# EAGLE design TorquePotSch (EAGLE 9.5.1)
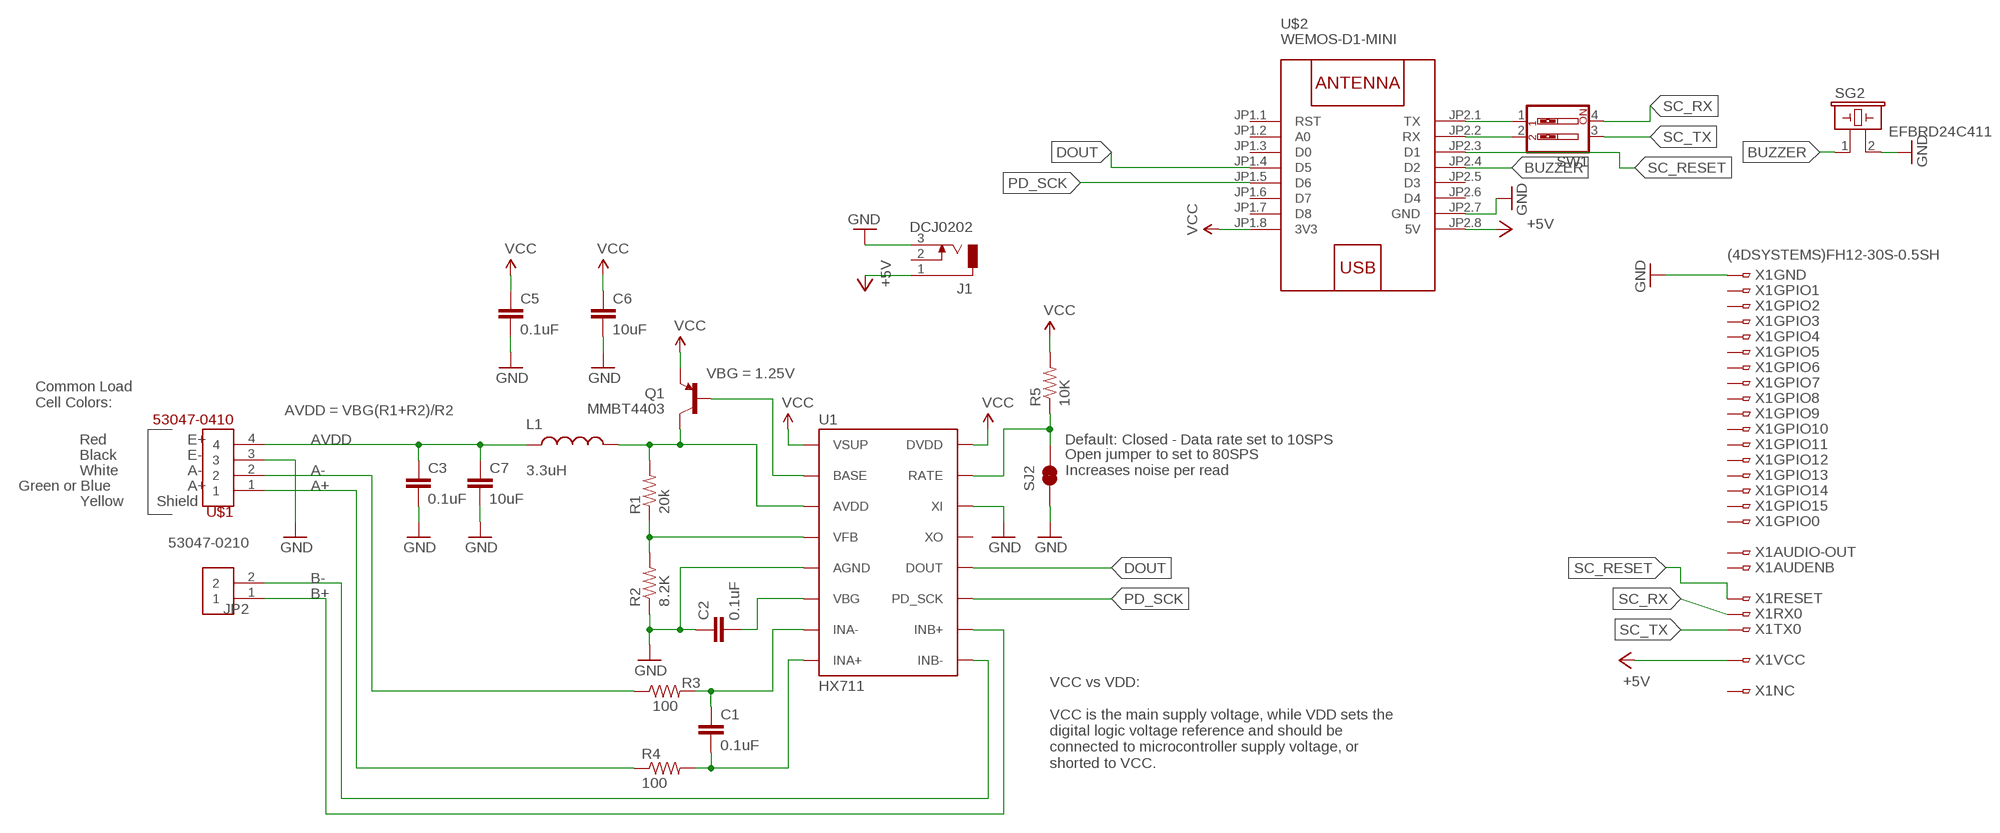
[diagram p0: schematic, sheet 1]

## Parts
C1  0.1uF  0.1UF-25V-5%(0603)  [0603-CAP]
C2  0.1uF  0.1UF-25V-5%(0603)  [0603-CAP]
C3  0.1uF  0.1UF-25V-5%(0603)  [0603-CAP]
C5  0.1uF  0.1UF-25V-5%(0603)  [0603-CAP]
C6  10uF  10UF50V20%(1210)  [1210]
C7  10uF  10UF50V20%(1210)  [1210]
J1  DCJ0202  [DCJ0202]
JP2  53047-0210  [53047-0210]
L1  3.3uH  INDUCTOR0805-IND  [0805]
Q1  MMBT4403  TRANSISTOR_PNPMMBT4403  [SOT23-3]
R1  20k  20KOHM1/10W1%(0603)  [0603-RES]
R2  8.2K  8.2KOHM-1/10W-5%(0603)  [0603-RES]
R3  100  100OHM-1/10W-1%(0603)  [0603-RES]
R4  100  100OHM-1/10W-1%(0603)  [0603-RES]
R5  10K  10KOHM-1/10W-1%(0603)0603  [0603-RES]
SG2  EFBRD24C411  [RS511-7620]
SJ2  JUMPER-PAD-2-NC_BY_TRACE  [PAD-JUMPER-2-NC_BY_TRACE_YES_SILK]
SW1  SW_DIP-2  [EDG-02]
U1  HX711  HX711HX711  [SO16]
U$1  53047-0410  [53047-0410]
U$2  WEMOS-D1-MINI  [WEMOS-D1-MINI]
X1  (4DSYSTEMS)FH12-30S-0.5SH  [FH12-30S-0.5SH]

## Nets
+5V: J1.1 U$2.JP2.8(5V) X1.26 X1.27
A+: R4.1 U$1.1
A-: R3.1 U$1.2
AVDD: C3.1 C7.1 L1.1 U$1.4
B+: JP2.1 U1.10(INB+)
B-: JP2.2 U1.9(INB-)
BUZZER: SG2.1 U$2.JP2.4(D2)
DOUT: U1.12(DOUT) U$2.JP1.4(D5)
GND: C2.1 C3.2 C5.2 C6.2 C7.2 J1.3 R2.1 SG2.2 SJ2.1 U1.5(AGND) U1.14(XI) U$1.3 U$2.JP2.7(GND) X1.1 X1.21 X1.25 X1.30
N$1: R5.1 SJ2.2 U1.15(RATE)
N$2: C1.1 R3.2 U1.7(INA-)
N$3: C1.2 R4.2 U1.8(INA+)
N$4: Q1.1(B) U1.2(BASE)
N$5: L1.2 Q1.3(C) R1.2 U1.3(AVDD)
N$6: R1.1 R2.2 U1.4(VFB)
N$7: C2.2 U1.6(VBG)
N$8: SW1.1 U$2.JP2.1(TX)
N$9: SW1.2 U$2.JP2.2(RX)
PD_SCK: U1.11(PD_SCK) U$2.JP1.5(D6)
SC_RESET: U$2.JP2.3(D1) X1.22
SC_RX: SW1.4 X1.23
SC_TX: SW1.3 X1.24
VCC: C5.1 C6.1 Q1.2(E) R5.2 U1.1(VSUP) U1.16(DVDD) U$2.JP1.8(3V3)
Unconnected: J1.2 U1.13(XO) U$2.JP1.1(RST) U$2.JP1.2(A0) U$2.JP1.3(D0) U$2.JP1.6(D7) U$2.JP1.7(D8) U$2.JP2.5(D3) U$2.JP2.6(D4) X1.2 X1.3 X1.4 X1.5 X1.6 X1.7 X1.8 X1.9 X1.10 X1.11 X1.12 X1.13 X1.14 X1.15 X1.16 X1.17 X1.18 X1.19 X1.20 X1.28 X1.29

## Notes on the sheet
- VBG = 1.25V
- Common Load
  Cell Colors:
- AVDD = VBG(R1+R2)/R2
- Red | E+ | Default: Closed - Data rate set to 10SPS
- Black | E-
- White | A-
- Open jumper to set to 80SPS
  Increases noise per read
- Green or Blue | A+
- Yellow | Shield
- VCC vs VDD:
  
  VCC is the main supply voltage, while VDD sets the
  digital logic voltage reference and should be
  connected to microcontroller supply voltage, or
  shorted to VCC.

## Library data of the parts
C1-C3 C5 = SparkFun-Capacitors:0.1UF-25V-5%(0603): CAP-08604; PROD_ID: CAP-08604
C6 C7 = SparkFun-Capacitors:10UF50V20%(1210): CAP-09824; PROD_ID: CAP-09824
J1 = personal:DCJ0202: DC POWER JACK Source: DCJ0202.pdf; OC_FARNELL: unknown; OC_NEWARK: unknown
JP2 = personal:53047-0210: Molex Picoblade 3 way PCB Header; SPICEPREFIX: B
L1 = SparkFun-Passives:INDUCTOR: Inductors Basic Inductor/Choke - 0603 and 1206. Footprints are not proven and vary greatly between part numbers. INDUCTOR POWER 3.3UH 4.0A SMD 0.197" L x 0.197" W x 0.177" H (5.00mm x 5.00mm x 4.50mm); PROD_ID: NDUC-13076
Q1 = SparkFun-DiscreteSemi:TRANSISTOR_PNP: Generic PNP BJT Double check pinouts against datasheets- not all devices are the same! MMBT3906 - 40V 200mA SOT-23 (TRANS-08052) MMBT4403 - 40V 600mA SOT-23 (TRANS-09245); PROD_ID: TRANS-09245
R1 = SparkFun-Resistors:20KOHM1/10W1%(0603): RES-09383; PROD_ID: RES-09383
R2 = SparkFun-Resistors:8.2KOHM-1/10W-5%(0603): RES-10646; PROD_ID: RES-10646
R3 R4 = SparkFun-Resistors:100OHM-1/10W-1%(0603): RES-07863; PROD_ID: RES-07863
R5 = SparkFun-Resistors:10KOHM-1/10W-1%(0603): RES-00824; PROD_ID: RES-00824
SG2 = personal:EFB?: Piezoelectric Acoustic Transducer Source: Panbasonic .. 2SC1685.pdf; OC_FARNELL: unknown; OC_NEWARK: unknown
SJ2 = SparkFun-Passives:JUMPER-PAD-2-NC_BY_TRACE
SW1 = personal:SW_DIP-2: DIP SWITCH
U1 = Testing:HX711; PROD_ID: IC-12445
U$1 = personal:53047-0410: Molex Picoblade 4 way PCB Header
U$2 = diy-modules:WEMOS-D1-MINI: WEMOS D1 mini: Mini Wi-Fi Board based on ESP-8266 device More details can be found here: https://www.wemos.cc/product/d1-mini.html Click here to find device on ebay.com <http://www.ebay.com/sch/wemos+d1+mini+nodemcu>
X1 = personal:(4DSYSTEMS)FH12-30S-0.5S: 0.5mm Pitch Connectors For FPC/FFC Source: Data sheet <http://www.hirose.co.jp/cataloge_hp/e58605370.pdf> 4d systems data sheet: Data sheet <https://4dsystems.com.au/mwdownloads/download/link/id/70/>; MPN: FH12-30S-0.5SH(55); OC_FARNELL: 1324555; OC_NEWARK: 34M6176

## Board
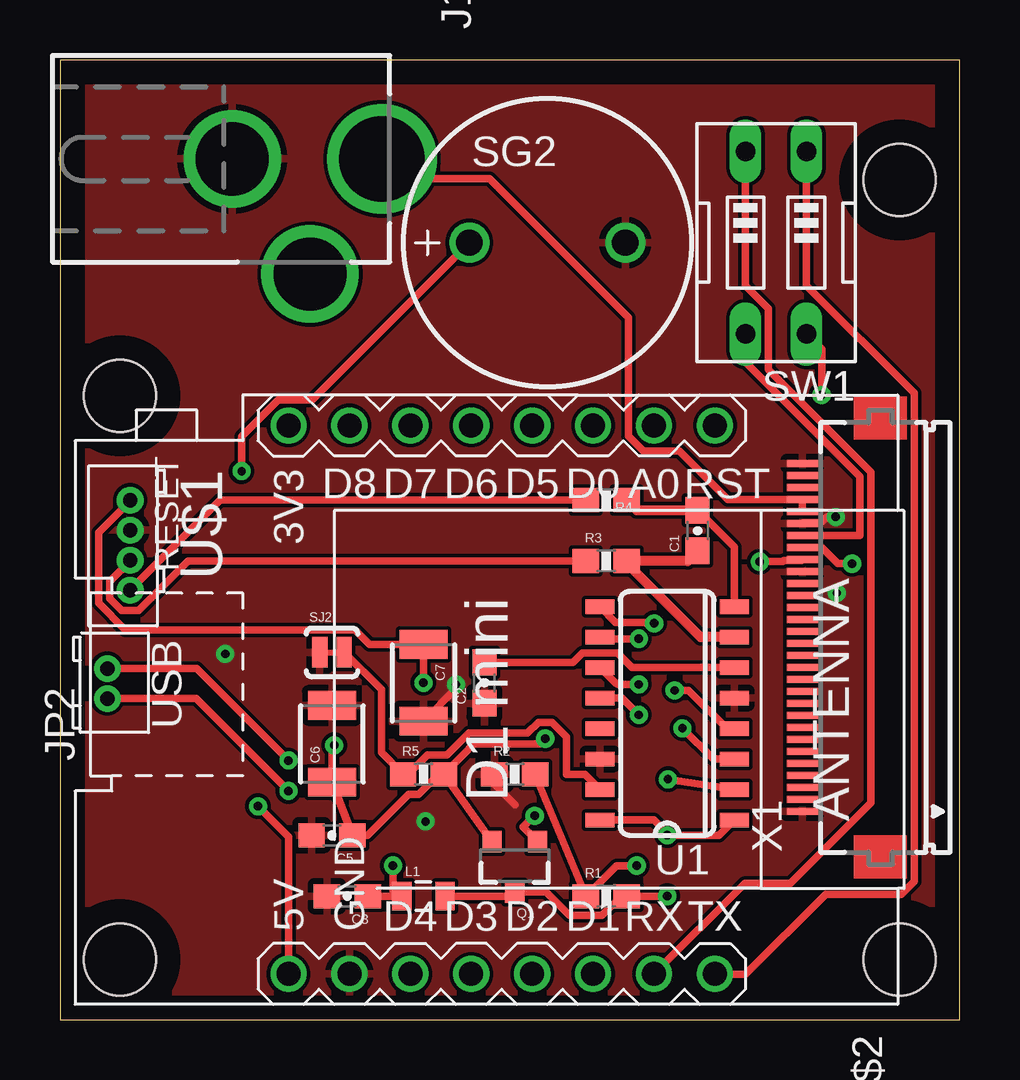
[diagram p1: board, top side]
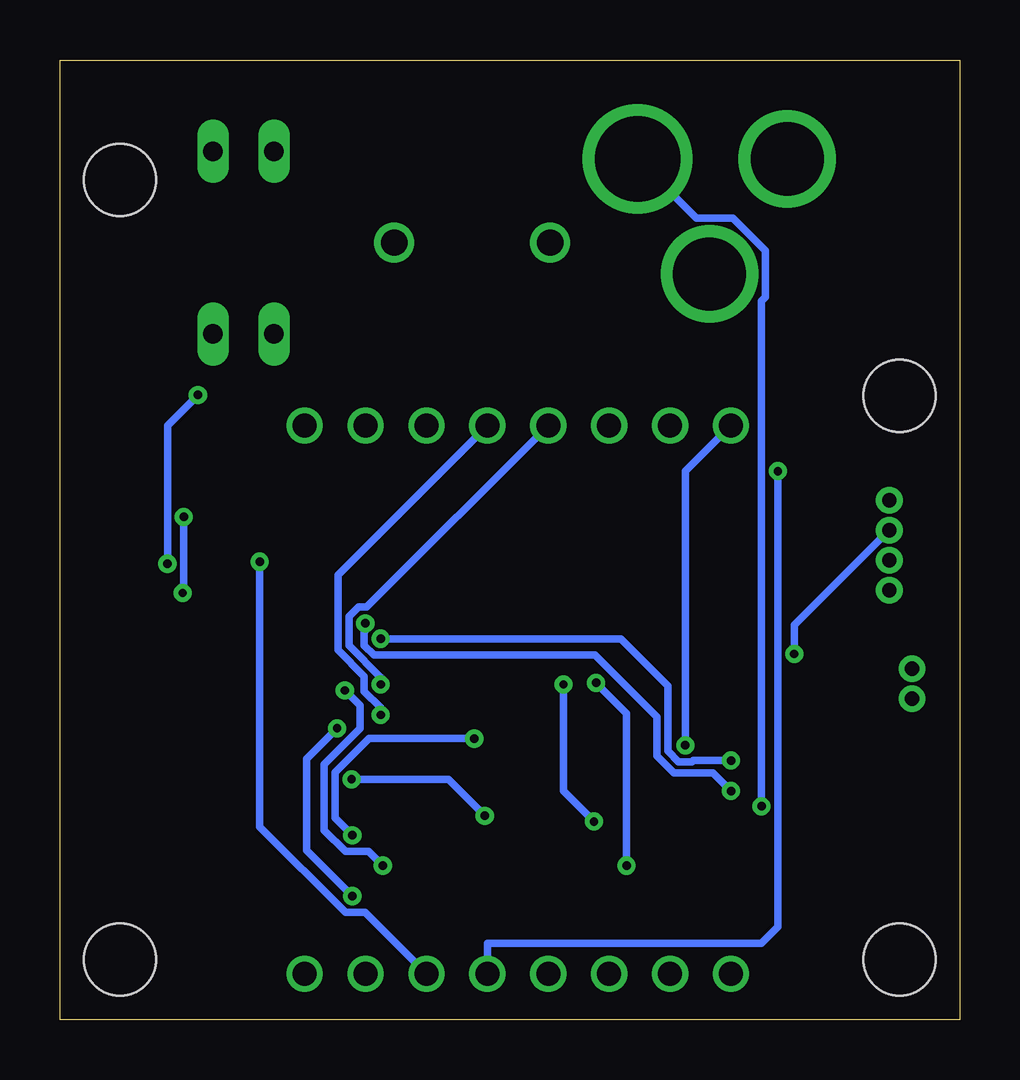
[diagram p2: board, bottom side, seen from below]

Size 37.5 x 40 mm. Coordinates in mm from the lower left corner, seen from the top.
Outline: 0,0 37.5,0 37.5,40 0,40 0,0
Copper layers (1*16): Top 0.035mm / dielectric 1.5mm / Bottom 0.035mm
Design rules "default": minimum track width 6mil, minimum drill 0.35mm, track to track 6mil, track to pad 6mil, pad to pad 6mil, via to via 6mil, smd to smd 6mil, copper to edge 40mil, drill to drill 6mil, minimum pad ring 10mil, minimum via ring 8mil, stop-mask expansion 4mil, vias tented up to drill 0mil, thermal gap 10mil
Holes 3 mm at 2.5,26 35,35 2.5,2.5 35,2.5

### Footprints (pad centres in the part's own frame; a part is rotated, then mirrored left to right if it is on the bottom)
0603-CAP = smd 1.1 x 1: 1 -0.85,0; 2 0.85,0
1210 = smd 1.2 x 2: 1 -1.6,0; 2 1.6,0
DCJ0202 = drill 3.56: 1 0,13.74 | drill 3.05: 2 4.8,10.74; 3 0,7.498
53047-0210 = drill 0.6 pad 1.016: 1 2.5,0.475; 2 1.25,0.475
0805 = smd 0.8 x 1.2: 1 -0.9,0; 2 0.9,0
SOT23-3 = smd 0.8 x 0.9: 1 -0.95,-1; 2 0.95,-1; 3 0,1.1
0603-RES = smd 1.1 x 1: 1 -0.85,0; 2 0.85,0
RS511-7620 = drill 1.1 pad 1.676: 1 -3.25,0; 2 3.25,0
PAD-JUMPER-2-NC_BY_TRACE_YES_SILK = smd 0.635 x 1.27: 1 -0.508,0; 2 0.508,0
EDG-02 = drill 0.813 long: 1 -1.27,-3.81; 2 1.27,-3.81; 3 1.27,3.81; 4 -1.27,3.81
SO16 = smd 0.6 x 1.2: 1 -4.445,-2.8; 2 -3.175,-2.8; 3 -1.905,-2.8; 4 -0.635,-2.8; 5 0.635,-2.8; 6 1.905,-2.8; 7 3.175,-2.8; 8 4.445,-2.8; 9 4.445,2.8; 10 3.175,2.8; 11 1.905,2.8; 12 0.635,2.8; 13 -0.635,2.8; 14 -1.905,2.8; 15 -3.175,2.8; 16 -4.445,2.8
53047-0410 = drill 0.6 pad 1.016: 1 3.75,0.475; 2 2.5,0.475; 3 1.25,0.475; 4 0,0.475
WEMOS-D1-MINI = drill 1: JP1.1 -11.43,9.525; JP1.2 -11.43,6.985; JP1.3 -11.43,4.445; JP1.4 -11.43,1.905; JP1.5 -11.43,-0.635; JP1.6 -11.43,-3.175; JP1.7 -11.43,-5.715; JP1.8 -11.43,-8.255; JP2.1 11.43,9.525; JP2.2 11.43,6.985; JP2.3 11.43,4.445; JP2.4 11.43,1.905; JP2.5 11.43,-0.635; JP2.6 11.43,-3.175; JP2.7 11.43,-5.715; JP2.8 11.43,-8.255
FH12-30S-0.5SH = smd 0.3 x 1.3: 1 -7.25,3.25; 2 -6.75,3.25; 3 -6.25,3.25; 4 -5.75,3.25; 5 -5.25,3.25; 6 -4.75,3.25; 7 -4.25,3.25; 8 -3.75,3.25; 9 -3.25,3.25; 10 -2.75,3.25; 11 -2.25,3.25; 12 -1.75,3.25; 13 -1.25,3.25; 14 -0.75,3.25; 15 -0.25,3.25; 16 0.25,3.25; 17 0.75,3.25; 18 1.25,3.25; 19 1.75,3.25; 20 2.25,3.25; 21 2.75,3.25; 22 3.25,3.25; 23 3.75,3.25; 24 4.25,3.25; 25 4.75,3.25; 26 5.25,3.25; 27 5.75,3.25; 28 6.25,3.25; 29 6.75,3.25; 30 7.25,3.25

### Placement (x,y rotation side)
C1  26.58,20.38 90 top
C2  17.69,14.03 90 top
C3  11.98,5.14 180 top
C5  11.34,7.68 180 top
C6  11.34,11.49 90 top
C7  15.15,14.03 270 top
J1  -0.32,35.88 270 top
JP2  2.45,12.13 90 top
L1  15.15,5.14 0 top
Q1  18.96,6.41 180 top
R1  22.77,5.14 0 top
R2  18.96,10.22 0 top
R3  22.77,19.11 0 top
R4  22.77,21.65 0 top
R5  15.15,10.22 0 top
SG2  20.32,32.38 0 top
SJ2  11.34,15.3 0 top
SW1  29.84,32.38 180 top
U1  25.31,12.76 90 top
U$1  2.45,21.65 270 top
U$2  17.78,13.34 270 top
X1  34.2,15.93 90 top

### Tracks (layer width: path | path; a pad name or v marks a point on that pad's centre or on a via)
+5V  (via drill 0.35)
  Top 0.305: U$2.JP2.8 9.53,7.62 v8.26,8.89 | X1.26 X1.27 27.85,21.68 25.82,23.71 24.33,23.71 23.71,24.33 23.71,29.27 17.92,35.06 14.24,35.06 J1.1
  Bottom 0.305: v8.26,8.89 8.26,29.94 8.09,30.11 8.09,32.05 9.45,33.41 10.96,33.41 J1.1
A+
  Top 0.305: R4.1 6.68,21.65 U$1.1
A-
  Top 0.305: U$1.2 2.97,19.11 2.62,18.76 2.57,18.76 2.07,18.26 2.07,17.55 2.57,17.05 3.28,17.05 5.35,19.11 R3.1
AVDD  (via drill 0.35)
  Top 0.305: L1.1 13.88,5.14 | 13.88,5.14 C3.1 | v13.88,6.41 13.88,5.14 | U$1.4 2.93,21.62 1.61,20.3 1.61,17.36 2.73,16.24 12.29,16.24 12.9,15.63 C7.1 v15.15,14.03
  Bottom 0.305: v15.15,14.03 13.88,12.76 v13.88,6.41
B+  (via drill 0.35)
  Top 0.305: v9.53,10.79 5.69,14.63 JP2.1 | v24.13,15.88 22.57,15.88 U1.10
  Bottom 0.305: v9.53,10.79 11.1,10.79 11.15,10.75 11.71,10.75 12.15,11.19 12.15,13.91 14.12,15.88 v24.13,15.88
B-  (via drill 0.35)
  Top 0.305: v9.53,9.53 5.67,13.38 JP2.2 | v24.77,16.52 24.45,16.52 24.41,16.56 23.16,16.56 U1.9
  Bottom 0.305: v24.77,16.52 24.77,16.2 24.81,16.16 24.81,15.59 24.41,15.19 15.19,15.19 12.61,12.61 12.61,11 11.9,10.29 10.29,10.29 v9.53,9.53
BUZZER  (via drill 0.35)
  Top 0.305: SG2.1 10.51,25.82 9.09,25.82 7.57,24.31 v7.57,22.86
  Bottom 0.305: v7.57,22.86 7.57,3.86 8.26,3.17 19.68,3.17 U$2.JP2.4
DOUT  (via drill 0.35)
  Top 0.305: U1.12 23.43,13.4 v24.13,12.7
  Bottom 0.305: v24.13,12.7 24.13,13 24.81,13.69 24.81,14.3 25.91,15.4 25.91,18.54 U$2.JP1.4
GND  (via drill 0.35)
  Top 0.305: R2.1 18.11,9.8 18.96,8.95 | C7.2 16.51,13.79 v16.51,13.97 | X1.25 30.99,20.72 31.73,20.72 31.96,20.95 v32.34,20.95
  Bottom 0.305: v16.51,13.97 16.51,9.53 v15.24,8.26 | v32.34,20.95 32.34,17.83 v32.38,17.78 | U$1.3 6.89,16.44 v6.89,15.24
  pour Top: 0,0 0,40 37.5,40 37.5,0
N$1
  Top 0.305: SJ2.2 13.4,13.75 13.4,11.13 R5.1 14.52,10.22 15.32,11.03 16.14,11.03 17.06,11.94 19.5,11.94 19.95,12.39 20.51,12.39 21.12,11.79 21.12,10.22 21.88,10.22 U1.15
N$2
  Top 0.406: U1.7 26.71,15.94 23.62,19.03 R3.2 26.16,19.11 C1.1
N$3
  Top 0.305: C1.2 28.11,19.7 U1.8
  Top 0.406: R4.2 24.04,21.23 C1.2
N$4  (via drill 0.35)
  Top 0.305: Q1.1 19.3,8.02 19.77,8.5 v19.79,8.5 | v25.34,10.02 U1.2
  Bottom 0.305: v19.79,8.5 21.31,10.02 v25.34,10.02
N$5  (via drill 0.35)
  Top 0.305: v25.31,5.14 R1.2 23.4,5.14 22.6,4.34 21.25,4.34 20.27,5.31 Q1.3 18.79,5.14 L1.2 | U1.3 27.23,10.86 v25.95,12.14
  Bottom 0.305: v25.31,5.14 27.22,7.05 27.22,10.87 v25.95,12.14
N$6  (via drill 0.35)
  Top 0.305: R2.2 R1.1 23.19,6.41 v24.04,6.41 | U1.4 27.79,12.13 26.2,13.72 v25.62,13.72
  Bottom 0.305: v25.62,13.72 24.99,13.09 24.99,12.13 26.49,10.63 26.49,7.89 25.59,7 24.63,7 v24.04,6.41
N$7
  Top 0.305: C2.2 21.39,14.88 21.79,15.27 23.24,15.27 23.84,14.67 U1.6
N$8
  Top 0.305: SW1.1 31.11,30.6 35.61,26.11 35.61,5.75 35.08,5.22 31.92,5.22 28.58,1.89 27.58,1.89 27.57,1.91 U$2.JP2.1
N$9
  Top 0.305: SW1.2 28.57,30.6 29.54,29.64 29.54,27.09 33.81,22.82 33.81,9.04 30.46,5.68 28.54,5.68 U$2.JP2.2
PD_SCK  (via drill 0.35)
  Top 0.305: v24.13,13.97 23.27,13.97 23.24,14 23.18,14 U1.11
  Bottom 0.305: v24.13,13.97 24.13,14.26 25.46,15.59 25.46,16.8 25.06,17.2 24.71,17.2 U$2.JP1.5
SC_RESET  (via drill 0.35)
  Top 0.305: X1.22 30.91,19.13 30.18,19.13 30.13,19.09 v29.17,19.09
  Bottom 0.305: U$2.JP2.3 24.78,4.46 25.59,4.46 29.17,8.04 v29.17,19.09
SC_RX  (via drill 0.35)
  Top 0.305: SW1.4 31.75,27.94 v31.75,26.04 | v33.02,19 32.43,19 31.75,19.68 31.74,19.68 X1.23
  Bottom 0.305: v31.75,26.04 33.02,24.77 v33.02,19
SC_TX
  Top 0.305: SW1.3 28.57,27.41 33.35,22.63 33.35,20.18 X1.24
VCC  (via drill 0.35)
  Top 0.305: Q1.2 R5.2 | R5.2 15.78,10.22 14.95,9.39 14.53,9.39 12.82,7.68 C5.1 C6.1 11.34,11.34 v11.43,11.43 | v20.23,11.71 20,11.49 17.25,11.49 16.8,11.04 16.8,11.02 R5.2 | v25.31,7.68 25.4,7.68 | 25.4,7.68 27.48,7.68 U1.1 | U1.16 24.77,8.32 25.4,7.68
  Bottom 0.305: v25.31,7.68 26.03,8.4 26.03,10.3 24.62,11.71 v20.23,11.71 | v11.43,11.43 11.43,22.86 U$2.JP1.8